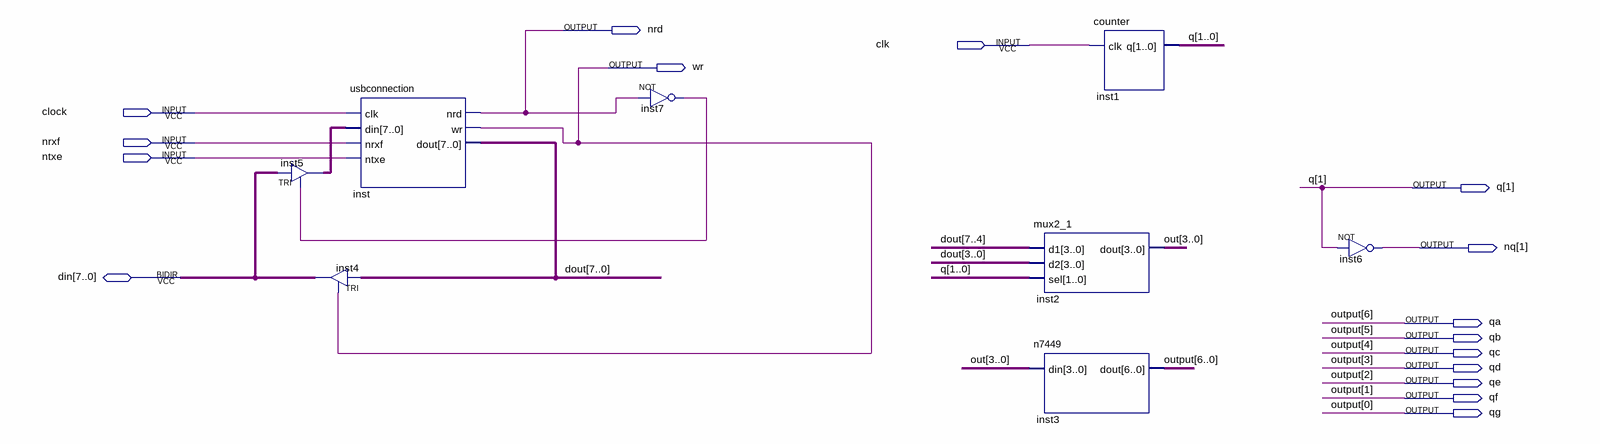
[diagram p0: schematic sheet]
// Quartus schematic connection.bdf as structural Verilog: 8 symbols, 16 pins
module connection (
  input  clk,
  input  clock,
  input  nrxf,
  input  ntxe,
  inout  [7:0] din,
  output nrd,
  output wr,
  output [1:0] q,
  output [1:1] nq,
  output qa,
  output qb,
  output qc,
  output qd,
  output qe,
  output qf,
  output qg
);

  wire inst7_out;
  wire [3:0] out;
  wire [7:0] dout, inst5_out;

  TRI inst5[7:0] (.IN(din), .OE(inst7_out), .OUT(inst5_out));
  TRI inst4[7:0] (.IN(dout), .OE(wr), .OUT(din));
  usbconnection inst (.clk(clock), .din(inst5_out), .nrxf(nrxf), .ntxe(ntxe), .nrd(nrd), .wr(wr), .dout(dout));
  not inst7 (inst7_out, nrd);
  mux2_1 inst2 (.d1(dout[7:4]), .d2(dout[3:0]), .sel(q), .dout(out));
  n7449 inst3 (.din(out), .dout({qa, qb, qc, qd, qe, qf, qg}));
  counter inst1 (.clk(clk), .q(q));
  not inst6 (nq[1], q[1]);

  // Other names for the same wires on the sheet: output[6:0] = {qa, qb, qc, qd, qe, qf, qg}
endmodule
